# EAGLE design ServoCapeBareBones (EAGLE 7.2.0)
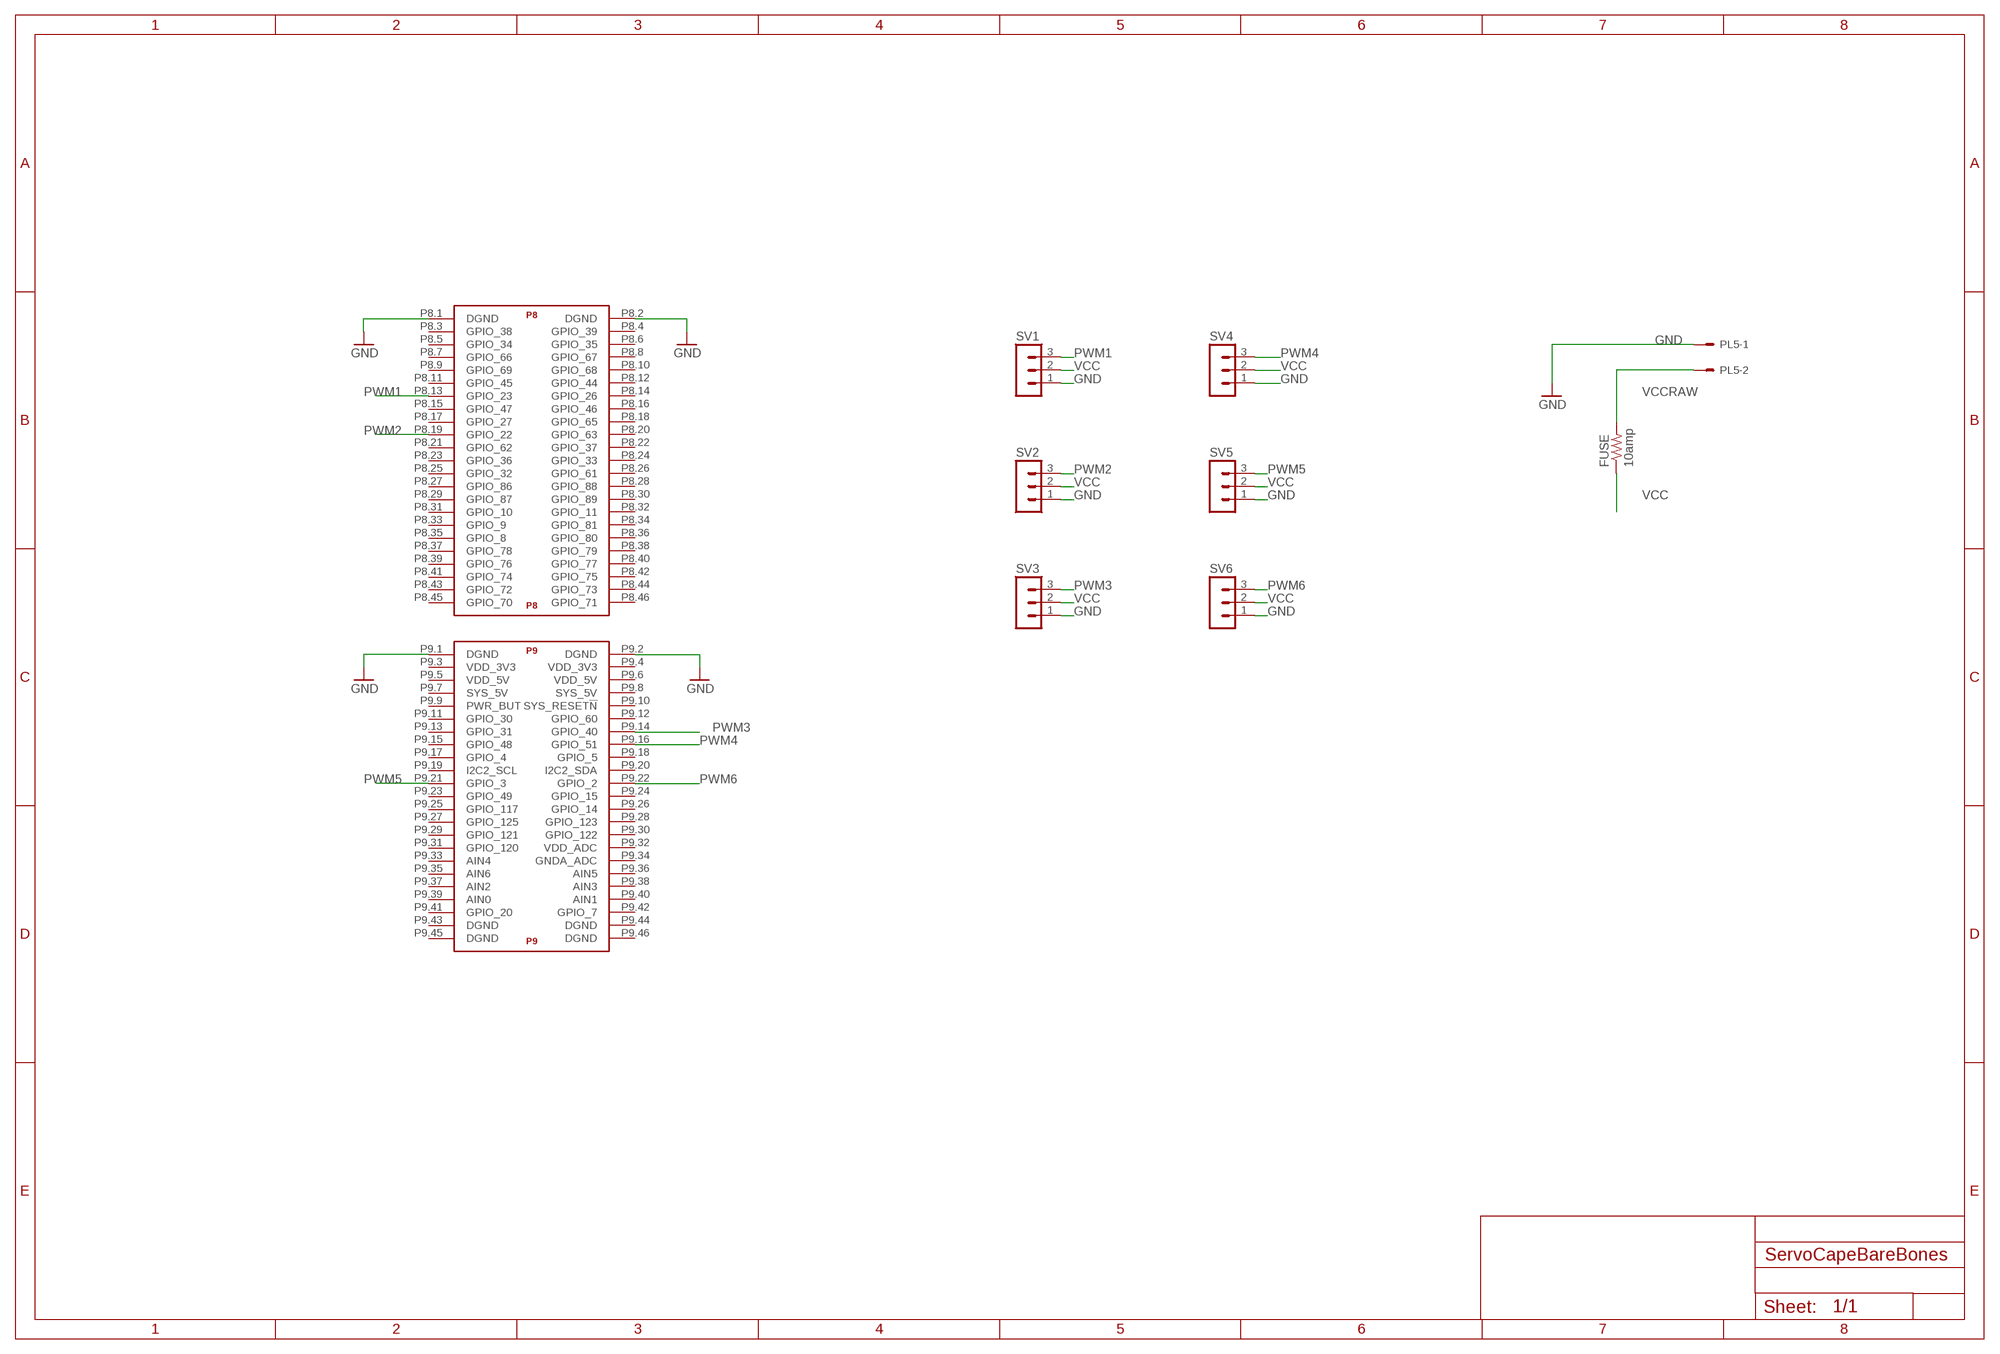
[diagram p0: schematic, sheet 1]

## Parts
FUSE  10amp  R-US_R1206  [R1206]
PL5  555X-2H  [5569-2]
SV1  MA03-1  [MA03-1]
SV2  MA03-1  [MA03-1]
SV3  MA03-1  [MA03-1]
SV4  MA03-1  [MA03-1]
SV5  MA03-1  [MA03-1]
SV6  MA03-1  [MA03-1]
U$1  BEAGLE_BONE_BLACK_CAPE  [BEAGLE_BONE_BLACK_CAPE]

## Nets
GND: PL5.1 SV1.1 SV2.1 SV3.1 SV4.1 SV5.1 SV6.1 U$1.P8.1(P8:DGND) U$1.P8.2(P8:DGND) U$1.P9.1(P9:DGND) U$1.P9.2(P9:DGND)
PWM1: SV1.3 U$1.P8.13(P8:GPIO_23)
PWM2: SV2.3 U$1.P8.19(P8:GPIO_22)
PWM3: SV3.3 U$1.P9.14(P9:GPIO_40)
PWM4: SV4.3 U$1.P9.16(P9:GPIO_51)
PWM5: SV5.3 U$1.P9.21(P9:GPIO_3)
PWM6: SV6.3 U$1.P9.22(P9:GPIO_2)
VCC: FUSE.1 SV1.2 SV2.2 SV3.2 SV4.2 SV5.2 SV6.2
VCCRAW: FUSE.2 PL5.2
Unconnected: U$1.P8.3(P8:GPIO_38) U$1.P8.4(P8:GPIO_39) U$1.P8.5(P8:GPIO_34) U$1.P8.6(P8:GPIO_35) U$1.P8.7(P8:GPIO_66) U$1.P8.8(P8:GPIO_67) U$1.P8.9(P8:GPIO_69) U$1.P8.10(P8:GPIO_68) U$1.P8.11(P8:GPIO_45) U$1.P8.12(P8:GPIO_44) U$1.P8.14(P8:GPIO_26) U$1.P8.15(P8:GPIO_47) U$1.P8.16(P8:GPIO_46) U$1.P8.17(P8:GPIO_27) U$1.P8.18(P8:GPIO_65) U$1.P8.20(P8:GPIO_63) U$1.P8.21(P8:GPIO_62) U$1.P8.22(P8:GPIO_37) U$1.P8.23(P8:GPIO_36) U$1.P8.24(P8:GPIO_33) U$1.P8.25(P8:GPIO_32) U$1.P8.26(P8:GPIO_61) U$1.P8.27(P8:GPIO_86) U$1.P8.28(P8:GPIO_88) U$1.P8.29(P8:GPIO_87) U$1.P8.30(P8:GPIO_89) U$1.P8.31(P8:GPIO_10) U$1.P8.32(P8:GPIO_11) U$1.P8.33(P8:GPIO_9) U$1.P8.34(P8:GPIO_81) U$1.P8.35(P8:GPIO_8) U$1.P8.36(P8:GPIO_80) U$1.P8.37(P8:GPIO_78) U$1.P8.38(P8:GPIO_79) U$1.P8.39(P8:GPIO_76) U$1.P8.40(P8:GPIO_77) U$1.P8.41(P8:GPIO_74) U$1.P8.42(P8:GPIO_75) U$1.P8.43(P8:GPIO_72) U$1.P8.44(P8:GPIO_73) U$1.P8.45(P8:GPIO_70) U$1.P8.46(P8:GPIO_71) U$1.P9.3(P9:VDD_3V3) U$1.P9.4(P9:VDD_3V3) U$1.P9.5(P9:VDD_5V) U$1.P9.6(P9:VDD_5V) U$1.P9.7(P9:SYS_5V) U$1.P9.8(P9:SYS_5V) U$1.P9.9(P9:PWR_BUT) U$1.P9.10(P9:SYS_RESET!N) U$1.P9.11(P9:GPIO_30) U$1.P9.12(P9:GPIO_60) U$1.P9.13(P9:GPIO_31) U$1.P9.15(P9:GPIO_48) U$1.P9.17(P9:GPIO_4) U$1.P9.18(P9:GPIO_5) U$1.P9.19(P9:I2C2_SCL) U$1.P9.20(P9:I2C2_SDA) U$1.P9.23(P9:GPIO_49) U$1.P9.24(P9:GPIO_15) U$1.P9.25(P9:GPIO_117) U$1.P9.26(P9:GPIO_14) U$1.P9.27(P9:GPIO_125) U$1.P9.28(P9:GPIO_123) U$1.P9.29(P9:GPIO_121) U$1.P9.30(P9:GPIO_122) U$1.P9.31(P9:GPIO_120) U$1.P9.32(P9:VDD_ADC) U$1.P9.33(P9:AIN4) U$1.P9.34(P9:GNDA_ADC) U$1.P9.35(P9:AIN6) U$1.P9.36(P9:AIN5) U$1.P9.37(P9:AIN2) U$1.P9.38(P9:AIN3) U$1.P9.39(P9:AIN0) U$1.P9.40(P9:AIN1) U$1.P9.41(P9:GPIO_20) U$1.P9.42(P9:GPIO_7) U$1.P9.43(P9:DGND) U$1.P9.44(P9:DGND) U$1.P9.45(P9:DGND) U$1.P9.46(P9:DGND)

## Library data of the parts
FUSE = rcl:R-US_: RESISTOR, American symbol
PL5 = con-molex-2:555X-2: Mini FIT connector 2 way
SV1-SV6 = con-lstb:MA03-1: PIN HEADER; OC_FARNELL: unknown; OC_NEWARK: unknown
U$1 = SparkFun-Boards:BEAGLE_BONE_BLACK_CAPE

## Board
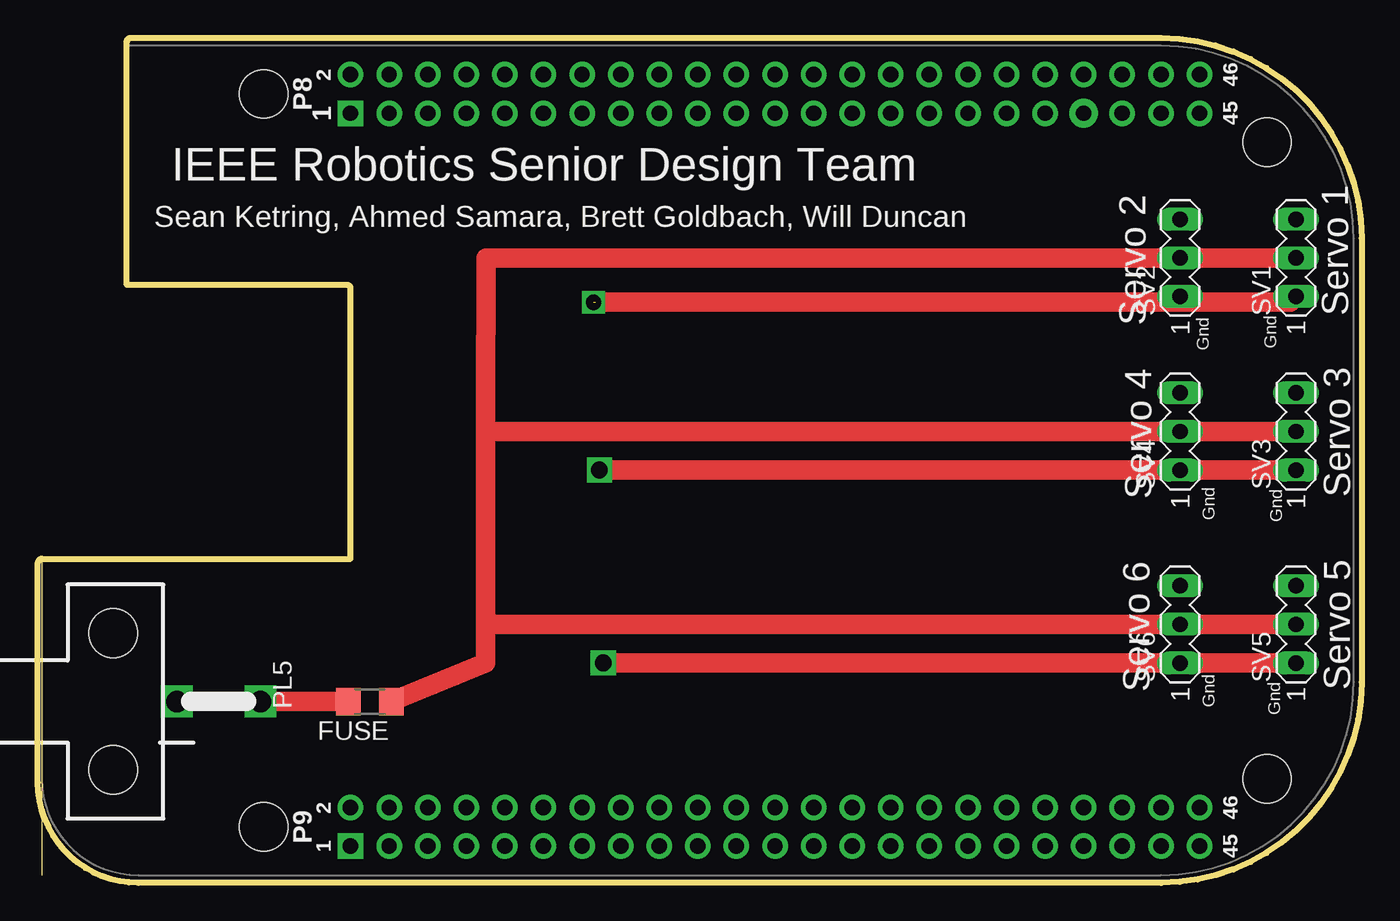
[diagram p1: board, top side]
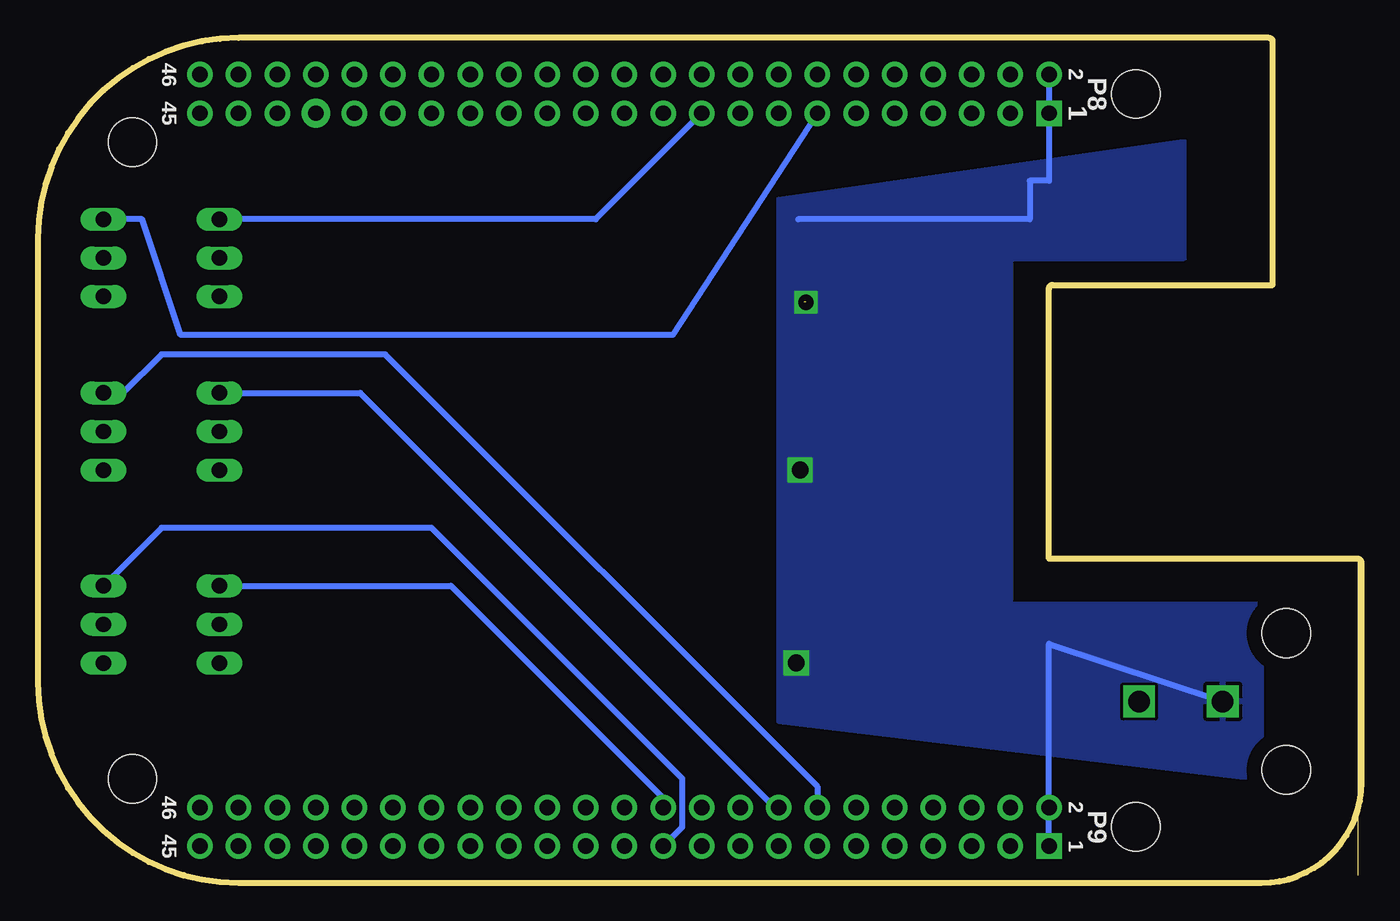
[diagram p2: board, bottom side, seen from below]

Size 87.12 x 55.63 mm. Coordinates in mm from the lower left corner, seen from the top.
Outline: 0.25,21.34 0.25,0.51
Outline: 0.25,21.34 arc90 0,21.08 0,6.6 arc90 6.6,0 73.91,0 arc90 87.12,13.21 87.12,42.42 arc90 73.91,55.63 6.1,55.63 arc90 5.84,55.37 5.84,39.37 20.32,39.37 arc-90 20.57,39.12 20.57,21.34 0.25,21.34
Copper layers (1*16): Top 0.035mm / dielectric 1.5mm / Bottom 0.035mm
Design rules "default": minimum track width 10mil, minimum drill 24mil, track to track 8mil, track to pad 8mil, pad to pad 8mil, via to via 8mil, smd to smd 8mil, copper to edge 40mil, drill to drill 8mil, minimum pad ring 10mil, minimum via ring 8mil, stop-mask expansion 4mil, vias tented up to drill 0mil, thermal gap 10mil

### Footprints (pad centres in the part's own frame; a part is rotated, then mirrored left to right if it is on the bottom)
R1206 = smd 1.6 x 1.803: 1 -1.422,0; 2 1.422,0
5569-2 = drill 1.4 square: 1 0,0; 2 0,5.5 | hole 3.2: 4.5,-4.2; -4.5,-4.2
MA03-1 = drill 1.016 long: 1 -2.54,0; 2 0,0; 3 2.54,0
BEAGLE_BONE_BLACK_CAPE = drill 1.016 pad 1.676 square: P8.1 20.32,50.165; P9.1 20.32,1.905 | drill 1.016 pad 1.676: P8.2 20.32,52.705; P8.3 22.86,50.165; P8.4 22.86,52.705; P8.5 25.4,50.165; P8.6 25.4,52.705; P8.7 27.94,50.165; P8.8 27.94,52.705; P8.9 30.48,50.165; P8.10 30.48,52.705; P8.11 33.02,50.165; P8.12 33.02,52.705; P8.13 35.56,50.165; P8.14 35.56,52.705; P8.15 38.1,50.165; P8.16 38.1,52.705; P8.17 40.64,50.165; P8.18 40.64,52.705; P8.19 43.18,50.165; P8.20 43.18,52.705; P8.21 45.72,50.165; P8.22 45.72,52.705; P8.23 48.26,50.165; P8.24 48.26,52.705; P8.25 50.8,50.165; P8.26 50.8,52.705; P8.27 53.34,50.165; P8.28 53.34,52.705; P8.29 55.88,50.165; P8.30 55.88,52.705; P8.31 58.42,50.165; P8.32 58.42,52.705; P8.33 60.96,50.165; P8.34 60.96,52.705; P8.35 63.5,50.165; P8.36 63.5,52.705; P8.37 66.04,50.165; P8.38 66.04,52.705; P8.40 68.58,52.705; P8.41 71.12,50.165; P8.42 71.12,52.705; P8.43 73.66,50.165; P8.44 73.66,52.705; P8.45 76.2,50.165; P8.46 76.2,52.705; P9.2 20.32,4.445; P9.3 22.86,1.905; P9.4 22.86,4.445; P9.5 25.4,1.905; P9.6 25.4,4.445; P9.7 27.94,1.905; P9.8 27.94,4.445; P9.9 30.48,1.905; P9.10 30.48,4.445; P9.11 33.02,1.905; P9.12 33.02,4.445; P9.13 35.56,1.905; P9.14 35.56,4.445; P9.15 38.1,1.905; P9.16 38.1,4.445; P9.17 40.64,1.905; P9.18 40.64,4.445; P9.19 43.18,1.905; P9.20 43.18,4.445; P9.21 45.72,1.905; P9.22 45.72,4.445; P9.23 48.26,1.905; P9.24 48.26,4.445; P9.25 50.8,1.905; P9.26 50.8,4.445; P9.27 53.34,1.905; P9.28 53.34,4.445; P9.29 55.88,1.905; P9.30 55.88,4.445; P9.31 58.42,1.905; P9.32 58.42,4.445; P9.33 60.96,1.905; P9.34 60.96,4.445; P9.35 63.5,1.905; P9.36 63.5,4.445; P9.37 66.04,1.905; P9.38 66.04,4.445; P9.39 68.58,1.905; P9.40 68.58,4.445; P9.41 71.12,1.905; P9.42 71.12,4.445; P9.43 73.66,1.905; P9.44 73.66,4.445; P9.45 76.2,1.905; P9.46 76.2,4.445 | drill 1.016 pad 1.88: P8.39 68.58,50.165 | hole 3.175: 14.605,3.175; 80.645,6.35; 80.645,48.26; 14.605,51.435

### Placement (x,y rotation side)
FUSE  21.84,11.94 180 top
PL5  9.14,11.94 270 top
SV1  82.8,41.15 90 top
SV2  75.18,41.15 90 top
SV3  82.8,29.72 90 top
SV4  75.18,29.72 90 top
SV5  82.8,17.02 90 top
SV6  75.18,17.02 90 top
U$1  0.25,0.51 0 top

### Tracks (layer width: path | path; a pad name or v marks a point on that pad's centre or on a via)
GND  (via drill 1, 1.1)  (1 unrouted)
  Top 0.406: SV2.1 SV1.1 82.42,38.23
  Top 1.27: v36.96,27.18 SV4.1 SV3.1 | SV5.1 SV6.1 v37.21,14.48 | 82.42,38.23 36.7,38.23
  Bottom 0.406: U$1.P8.2 U$1.P8.1 20.57,46.23 21.84,46.23 21.84,43.69 37.08,43.69 | U$1.P9.1 U$1.P9.2 20.57,15.75 PL5.1
  other vias: 36.58,38.23
  pour Bottom: 11.68,48.77 38.35,44.96 38.35,10.67 6.6,6.86 6.6,18.29 23.11,18.29 23.11,41.15 11.68,41.15
PWM1
  Bottom 0.406: U$1.P8.13 45.34,36.07 77.72,36.07 80.26,43.69 SV1.3
PWM2
  Bottom 0.406: U$1.P8.19 50.42,43.69 SV2.3 76.45,43.69
PWM3
  Bottom 0.406: SV3.3 81.53,32.26 78.99,34.8 64.26,34.8 35.81,6.35 U$1.P9.14
PWM4
  Bottom 0.406: SV4.3 65.91,32.26 38.61,4.95 U$1.P9.16
PWM5
  Bottom 0.406: U$1.P9.21 44.7,3.68 44.7,6.86 61.21,23.37 78.99,23.37 SV5.3
PWM6
  Bottom 0.406: SV6.3 59.94,19.56 45.97,5.59 U$1.P9.22
VCC
  Top 0.406: SV4.2 SV3.2 | 30.1,29.72 29.97,29.59 29.46,29.59
  Top 1.27: 29.46,17.02 29.46,14.48 FUSE.1 | 29.46,17.02 29.46,29.59 29.46,30.99 29.48,41.14 75.17,41.14 SV2.2 SV1.2 | SV3.2 30.1,29.72 | 29.46,17.02 SV6.2 SV5.2
VCCRAW
  Top 1.27: PL5.2 FUSE.2

### Text on the board
tPlace: IEEE Robotics Senior Design Team | Sean Ketring, Ahmed Samara, Brett Goldbach, Will Duncan | Servo 1 | Servo 2 | Gnd | Gnd | Servo 4 | Servo 3 | Gnd | Gnd | Servo 6 | Servo 5 | Gnd | Gnd